# EAGLE schematic Ulticlone (EAGLE 6.6.0)

## Sheet 1 of 5
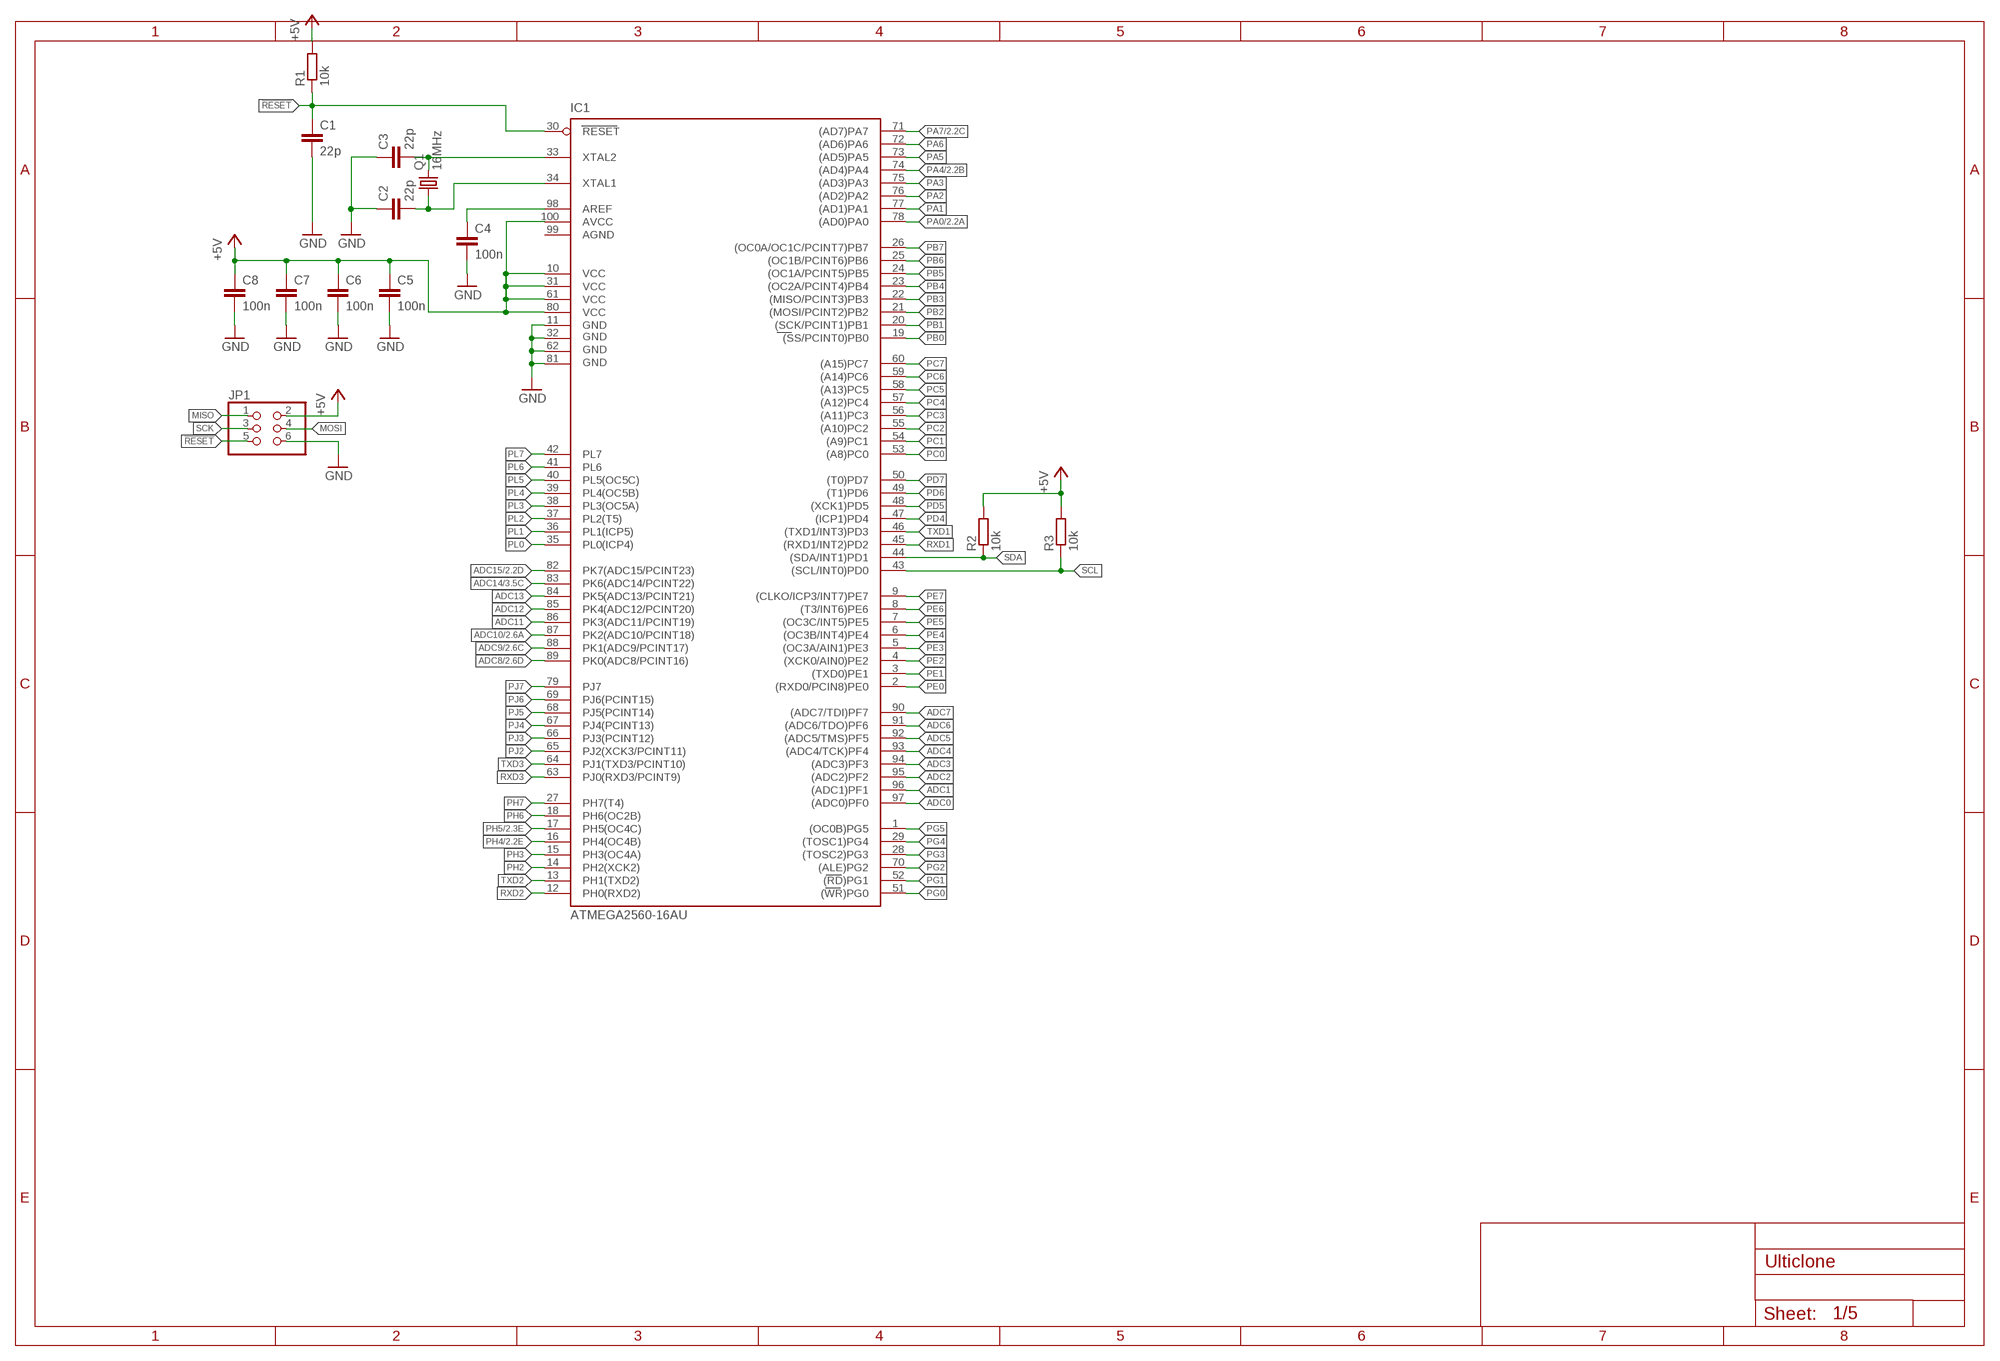
[diagram p0: schematic, sheet 1]

### Parts
C1  22p  C-EUC0603K  [C0603K]
C2  22p  C-EUC0603K  [C0603K]
C3  22p  C-EUC0603K  [C0603K]
C4  100n  C-EUC0603K  [C0603K]
C5  100n  C-EUC0603K  [C0603K]
C6  100n  C-EUC0603K  [C0603K]
C7  100n  C-EUC0603K  [C0603K]
C8  100n  C-EUC0603K  [C0603K]
IC1  ATMEGA2560-16AU  [TQFP100]
JP1  PINHD-2X3  [2X03]
Q1  16MHz  CRYSTALHC49UP  [HC49UP]
R1  10k  R-EU_R0603  [R0603]
R2  10k  R-EU_R0603  [R0603]
R3  10k  R-EU_R0603  [R0603]

### Nets
!RESET: C1.1 IC1.30(RESET) JP1.5 R1.1
+5V: C5.1 C6.1 C7.1 C8.1 IC1.10(VCC) IC1.31(VCC1) IC1.61(VCC2) IC1.80(VCC3) IC1.100(AVCC) JP1.2 R1.2 R2.2 R3.2 ; also sheet 2,3
ADC0: IC1.97((ADC0)PF0)
ADC1: IC1.96((ADC1)PF1)
ADC2: IC1.95((ADC2)PF2)
ADC3: IC1.94((ADC3)PF3)
ADC4: IC1.93((ADC4/TCK)PF4)
ADC5: IC1.92((ADC5/TMS)PF5)
ADC6: IC1.91((ADC6/TDO)PF6)
ADC7: IC1.90((ADC7/TDI)PF7)
ADC8: IC1.89(PK0(ADC8/PCINT16)) ; also sheet 2
ADC9: IC1.88(PK1(ADC9/PCINT17)) ; also sheet 2
ADC10: IC1.87(PK2(ADC10/PCINT18)) ; also sheet 2
ADC11: IC1.86(PK3(ADC11/PCINT19))
ADC12: IC1.85(PK4(ADC12/PCINT20))
ADC13: IC1.84(PK5(ADC13/PCINT21))
ADC14: IC1.83(PK6(ADC14/PCINT22)) ; also sheet 3
ADC15: IC1.82(PK7(ADC15/PCINT23)) ; also sheet 2
GND: C1.2 C2.1 C3.1 C4.2 C5.2 C6.2 C7.2 C8.2 IC1.11(GND) IC1.32(GND1) IC1.62(GND2) IC1.81(GND3) JP1.6 ; also sheet 2,3
MISO: JP1.1
MOSI: JP1.4
N$1: C3.2 IC1.33(XTAL2) Q1.2
N$2: C2.2 IC1.34(XTAL1) Q1.1
N$3: C4.1 IC1.98(AREF)
PA0: IC1.78((AD0)PA0) ; also sheet 2
PA1: IC1.77((AD1)PA1)
PA2: IC1.76((AD2)PA2)
PA3: IC1.75((AD3)PA3)
PA4: IC1.74((AD4)PA4) ; also sheet 2
PA5: IC1.73((AD5)PA5)
PA6: IC1.72((AD6)PA6)
PA7: IC1.71((AD7)PA7) ; also sheet 2
PB0: IC1.19((SS/PCINT0)PB0)
PB1: IC1.20((SCK/PCINT1)PB1)
PB2: IC1.21((MOSI/PCINT2)PB2)
PB3: IC1.22((MISO/PCINT3)PB3)
PB4: IC1.23((OC2A/PCINT4)PB4)
PB5: IC1.24((OC1A/PCINT5)PB5)
PB6: IC1.25((OC1B/PCINT6)PB6)
PB7: IC1.26((OC0A/OC1C/PCINT7)PB7)
PC0: IC1.53((A8)PC0)
PC1: IC1.54((A9)PC1)
PC2: IC1.55((A10)PC2)
PC3: IC1.56((A11)PC3)
PC4: IC1.57((A12)PC4)
PC5: IC1.58((A13)PC5)
PC6: IC1.59((A14)PC6)
PC7: IC1.60((A15)PC7)
PD4: IC1.47((ICP1)PD4)
PD5: IC1.48((XCK1)PD5)
PD6: IC1.49((T1)PD6)
PD7: IC1.50((T0)PD7)
PE0: IC1.2((RXD0/PCIN8)PE0)
PE1: IC1.3((TXD0)PE1)
PE2: IC1.4((XCK0/AIN0)PE2)
PE3: IC1.5((OC3A/AIN1)PE3)
PE4: IC1.6((OC3B/INT4)PE4)
PE5: IC1.7((OC3C/INT5)PE5)
PE6: IC1.8((T3/INT6)PE6)
PE7: IC1.9((CLKO/ICP3/INT7)PE7)
PG0: IC1.51((WR)PG0)
PG1: IC1.52((RD)PG1)
PG2: IC1.70((ALE)PG2)
PG3: IC1.28((TOSC2)PG3)
PG4: IC1.29((TOSC1)PG4)
PG5: IC1.1((OC0B)PG5)
PH2: IC1.14(PH2(XCK2))
PH3: IC1.15(PH3(OC4A))
PH4: IC1.16(PH4(OC4B)) ; also sheet 2
PH5: IC1.17(PH5(OC4C)) ; also sheet 2
PH6: IC1.18(PH6(OC2B))
PH7: IC1.27(PH7(T4))
PJ2: IC1.65(PJ2(XCK3/PCINT11))
PJ3: IC1.66(PJ3(PCINT12))
PJ4: IC1.67(PJ4(PCINT13))
PJ5: IC1.68(PJ5(PCINT14))
PJ6: IC1.69(PJ6(PCINT15))
PJ7: IC1.79(PJ7)
PL0: IC1.35(PL0(ICP4))
PL1: IC1.36(PL1(ICP5))
PL2: IC1.37(PL2(T5))
PL3: IC1.38(PL3(OC5A))
PL4: IC1.39(PL4(OC5B))
PL5: IC1.40(PL5(OC5C))
PL6: IC1.41(PL6)
PL7: IC1.42(PL7)
RXD1: IC1.45((RXD1/INT2)PD2)
RXD2: IC1.12(PH0(RXD2))
RXD3: IC1.63(PJ0(RXD3/PCINT9))
SCK: JP1.3
SCL: IC1.43((SCL/INT0)PD0) R3.1
SDA: IC1.44((SDA/INT1)PD1) R2.1
TXD1: IC1.46((TXD1/INT3)PD3)
TXD2: IC1.13(PH1(TXD2))
TXD3: IC1.64(PJ1(TXD3/PCINT10))

## Sheet 2 of 5
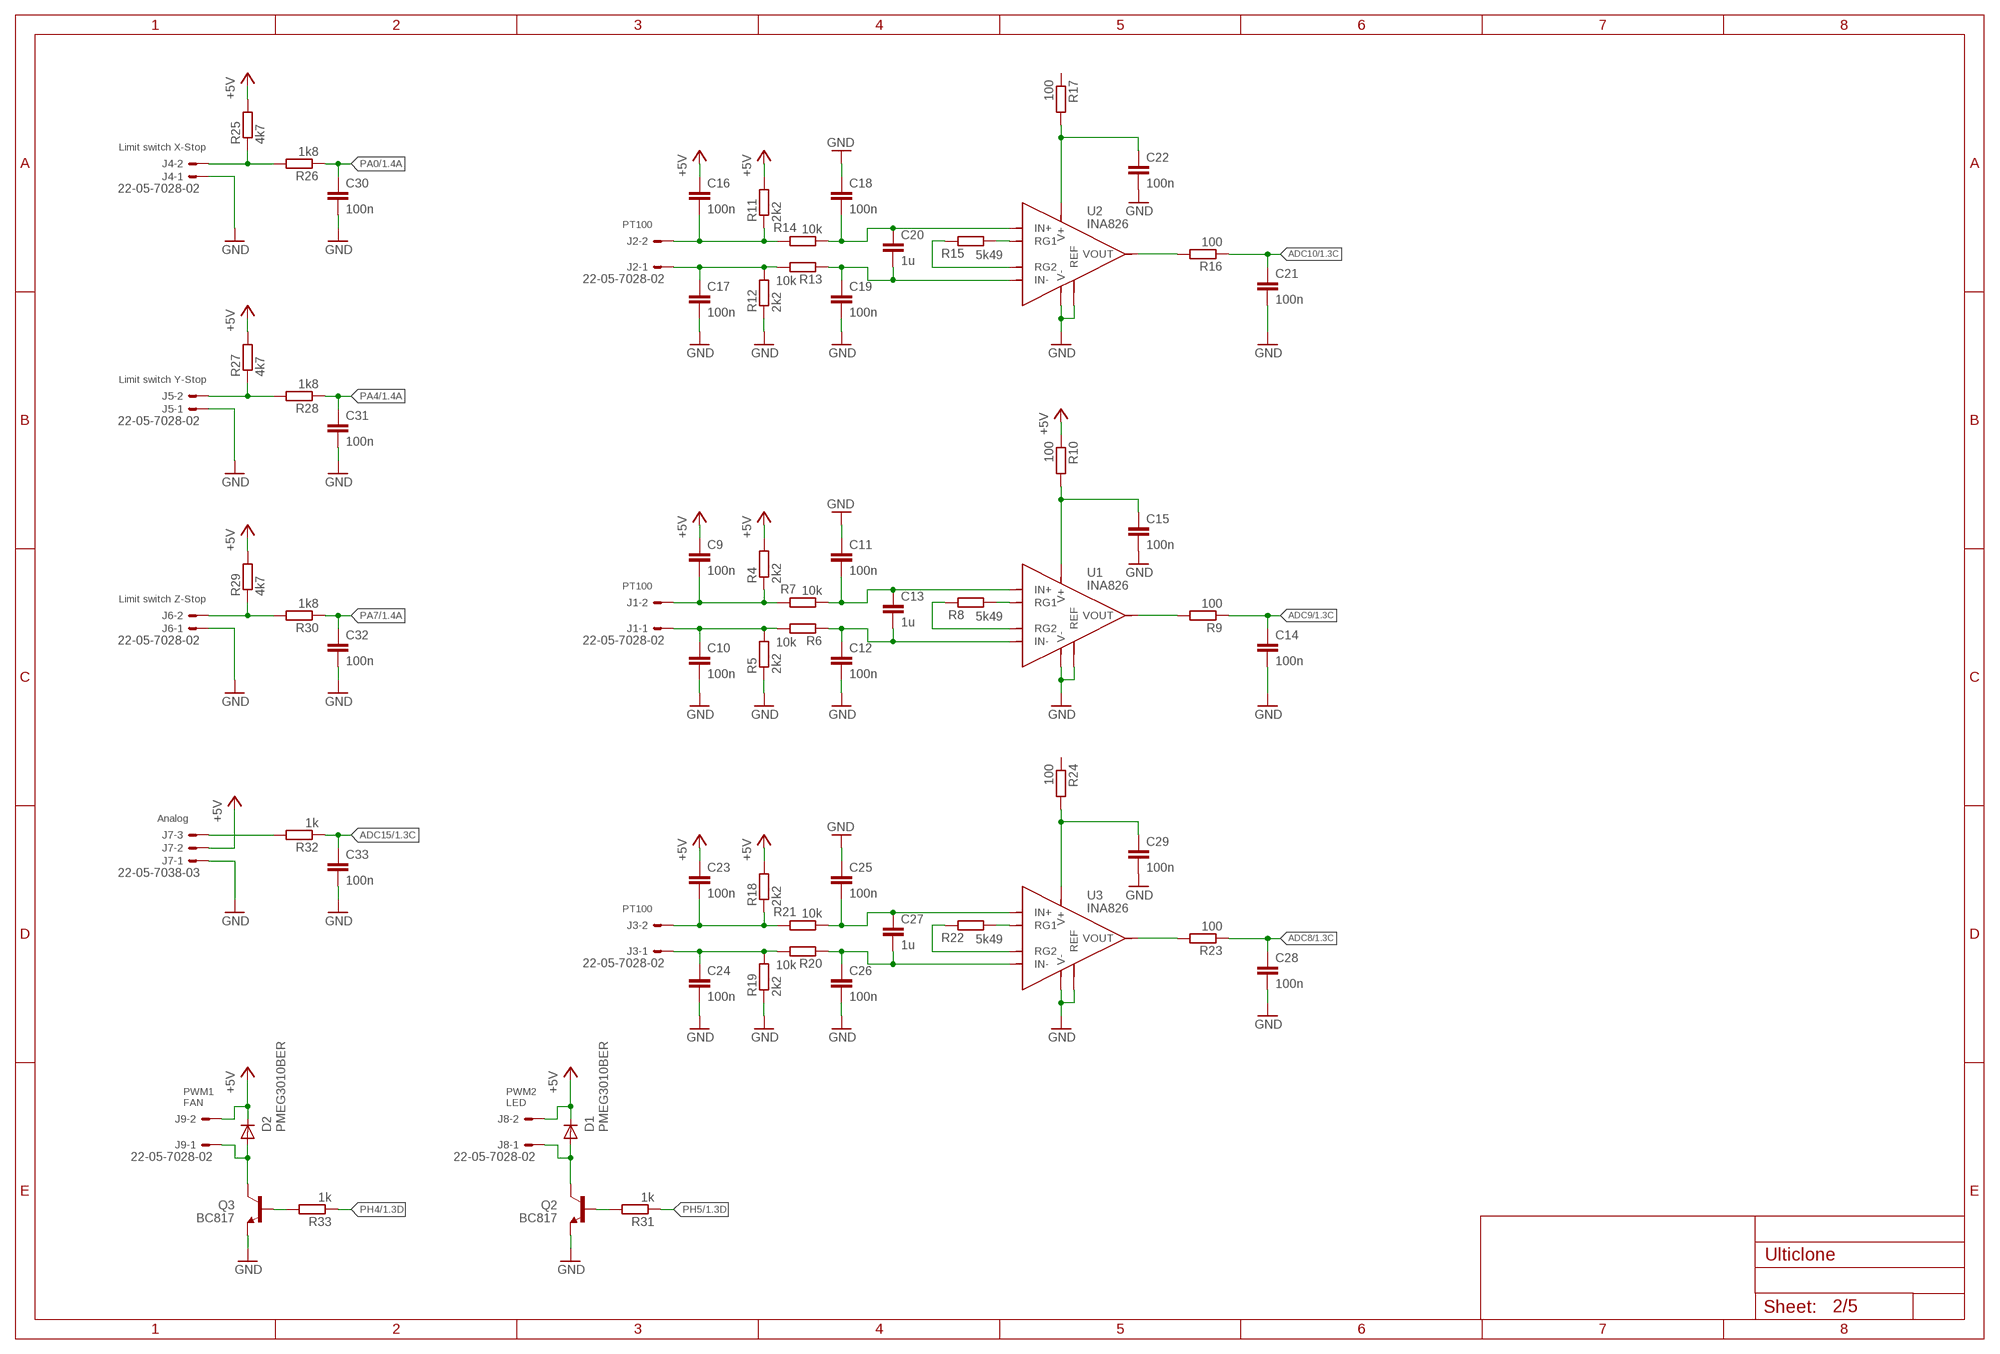
[diagram p1: schematic, sheet 2]

### Parts
C9  100n  C-EUC0603K  [C0603K]
C10  100n  C-EUC0603K  [C0603K]
C11  100n  C-EUC0603K  [C0603K]
C12  100n  C-EUC0603K  [C0603K]
C13  1u  C-EUC0805K  [C0805K]
C14  100n  C-EUC0603K  [C0603K]
C15  100n  C-EUC0603K  [C0603K]
C16  100n  C-EUC0603K  [C0603K]
C17  100n  C-EUC0603K  [C0603K]
C18  100n  C-EUC0603K  [C0603K]
C19  100n  C-EUC0603K  [C0603K]
C20  1u  C-EUC0805K  [C0805K]
C21  100n  C-EUC0603K  [C0603K]
C22  100n  C-EUC0603K  [C0603K]
C23  100n  C-EUC0603K  [C0603K]
C24  100n  C-EUC0603K  [C0603K]
C25  100n  C-EUC0603K  [C0603K]
C26  100n  C-EUC0603K  [C0603K]
C27  1u  C-EUC0805K  [C0805K]
C28  100n  C-EUC0603K  [C0603K]
C29  100n  C-EUC0603K  [C0603K]
C30  100n  C-EUC0603K  [C0603K]
C31  100n  C-EUC0603K  [C0603K]
C32  100n  C-EUC0603K  [C0603K]
C33  100n  C-EUC0603K  [C0603K]
D1  PMEG3010BER  DIODE-SOD123  [SOD123]
D2  PMEG3010BER  DIODE-SOD123  [SOD123]
J1  22-05-7028-02  [7395-02]
J2  22-05-7028-02  [7395-02]
J3  22-05-7028-02  [7395-02]
J4  22-05-7028-02  [7395-02]
J5  22-05-7028-02  [7395-02]
J6  22-05-7028-02  [7395-02]
J7  22-05-7038-03  [7395-03]
J8  22-05-7028-02  [7395-02]
J9  22-05-7028-02  [7395-02]
Q2  BC817  BC817-16SMD  [SOT23-BEC]
Q3  BC817  BC817-16SMD  [SOT23-BEC]
R4  2k2  R-EU_R0603  [R0603]
R5  2k2  R-EU_R0603  [R0603]
R6  10k  R-EU_R0603  [R0603]
R7  10k  R-EU_R0603  [R0603]
R8  5k49  R-EU_R0603  [R0603]
R9  100  R-EU_R0603  [R0603]
R10  100  R-EU_R0603  [R0603]
R11  2k2  R-EU_R0603  [R0603]
R12  2k2  R-EU_R0603  [R0603]
R13  10k  R-EU_R0603  [R0603]
R14  10k  R-EU_R0603  [R0603]
R15  5k49  R-EU_R0603  [R0603]
R16  100  R-EU_R0603  [R0603]
R17  100  R-EU_R0603  [R0603]
R18  2k2  R-EU_R0603  [R0603]
R19  2k2  R-EU_R0603  [R0603]
R20  10k  R-EU_R0603  [R0603]
R21  10k  R-EU_R0603  [R0603]
R22  5k49  R-EU_R0603  [R0603]
R23  100  R-EU_R0603  [R0603]
R24  100  R-EU_R0603  [R0603]
R25  4k7  R-EU_R0603  [R0603]
R26  1k8  R-EU_R0603  [R0603]
R27  4k7  R-EU_R0603  [R0603]
R28  1k8  R-EU_R0603  [R0603]
R29  4k7  R-EU_R0603  [R0603]
R30  1k8  R-EU_R0603  [R0603]
R31  1k  R-EU_R0603  [R0603]
R32  1k  R-EU_R0603  [R0603]
R33  1k  R-EU_R0603  [R0603]
U1  INA826  [SO-8]
U2  INA826  [SO-8]
U3  INA826  [SO-8]

### Nets
+5V: C9.1 C16.1 C23.1 D1.C D2.C J7.2 J8.2 J9.2 R4.2 R10.1 R11.2 R18.2 R25.2 R27.2 R29.2 ; also sheet 1,3
ADC8: C28.1 R23.1 ; also sheet 1
ADC9: C14.1 R9.1 ; also sheet 1
ADC10: C21.1 R16.1 ; also sheet 1
ADC15: C33.1 R32.1 ; also sheet 1
GND: C10.2 C11.1 C12.2 C14.2 C15.2 C17.2 C18.1 C19.2 C21.2 C22.2 C24.2 C25.1 C26.2 C28.2 C29.2 C30.2 C31.2 C32.2 C33.2 J4.1 J5.1 J6.1 J7.1 Q2.E Q3.E R5.1 R12.1 R19.1 U1.P$5(V-) U1.P$6(REF) U2.P$5(V-) U2.P$6(REF) U3.P$5(V-) U3.P$6(REF) ; also sheet 1,3
N$4: C9.2 J1.2 R4.1 R7.2
N$5: R8.2 U1.P$3(RG2)
N$6: C10.1 J1.1 R5.2 R6.2
N$7: C11.2 C13.1 R7.1 U1.P$4(IN+)
N$8: C12.1 C13.2 R6.1 U1.P$1(IN-)
N$9: R8.1 U1.P$2(RG1)
N$10: R9.2 U1.P$7(VOUT)
N$11: C15.1 R10.2 U1.P$8(V+)
N$12: J4.2 R25.1 R26.2
N$13: J7.3 R32.2
N$14: J5.2 R27.1 R28.2
N$15: J6.2 R29.1 R30.2
N$16: C16.2 J2.2 R11.1 R14.2
N$17: C17.1 J2.1 R12.2 R13.2
N$18: C18.2 C20.1 R14.1 U2.P$4(IN+)
N$19: C19.1 C20.2 R13.1 U2.P$1(IN-)
N$20: R15.1 U2.P$2(RG1)
N$21: R15.2 U2.P$3(RG2)
N$22: R16.2 U2.P$7(VOUT)
N$23: C22.1 R17.2 U2.P$8(V+)
N$24: C23.2 J3.2 R18.1 R21.2
N$25: C24.1 J3.1 R19.2 R20.2
N$26: C25.2 C27.1 R21.1 U3.P$4(IN+)
N$27: C26.1 C27.2 R20.1 U3.P$1(IN-)
N$28: R22.1 U3.P$2(RG1)
N$29: R22.2 U3.P$3(RG2)
N$30: R23.2 U3.P$7(VOUT)
N$31: C29.1 R24.2 U3.P$8(V+)
N$32: D1.A J8.1 Q2.C
N$35: Q2.B R31.2
N$37: D2.A J9.1 Q3.C
N$38: Q3.B R33.2
PA0: C30.1 R26.1 ; also sheet 1
PA4: C31.1 R28.1 ; also sheet 1
PA7: C32.1 R30.1 ; also sheet 1
PH4: R33.1 ; also sheet 1
PH5: R31.1 ; also sheet 1
Unconnected: R17.1 R24.1

### Notes on the sheet
- Limit switch X-Stop
- PT100
- Limit switch Y-Stop
- PT100
- Limit switch Z-Stop
- Analog
- PT100
- PWM1
  FAN
- PWM2
  LED

## Sheet 3 of 5
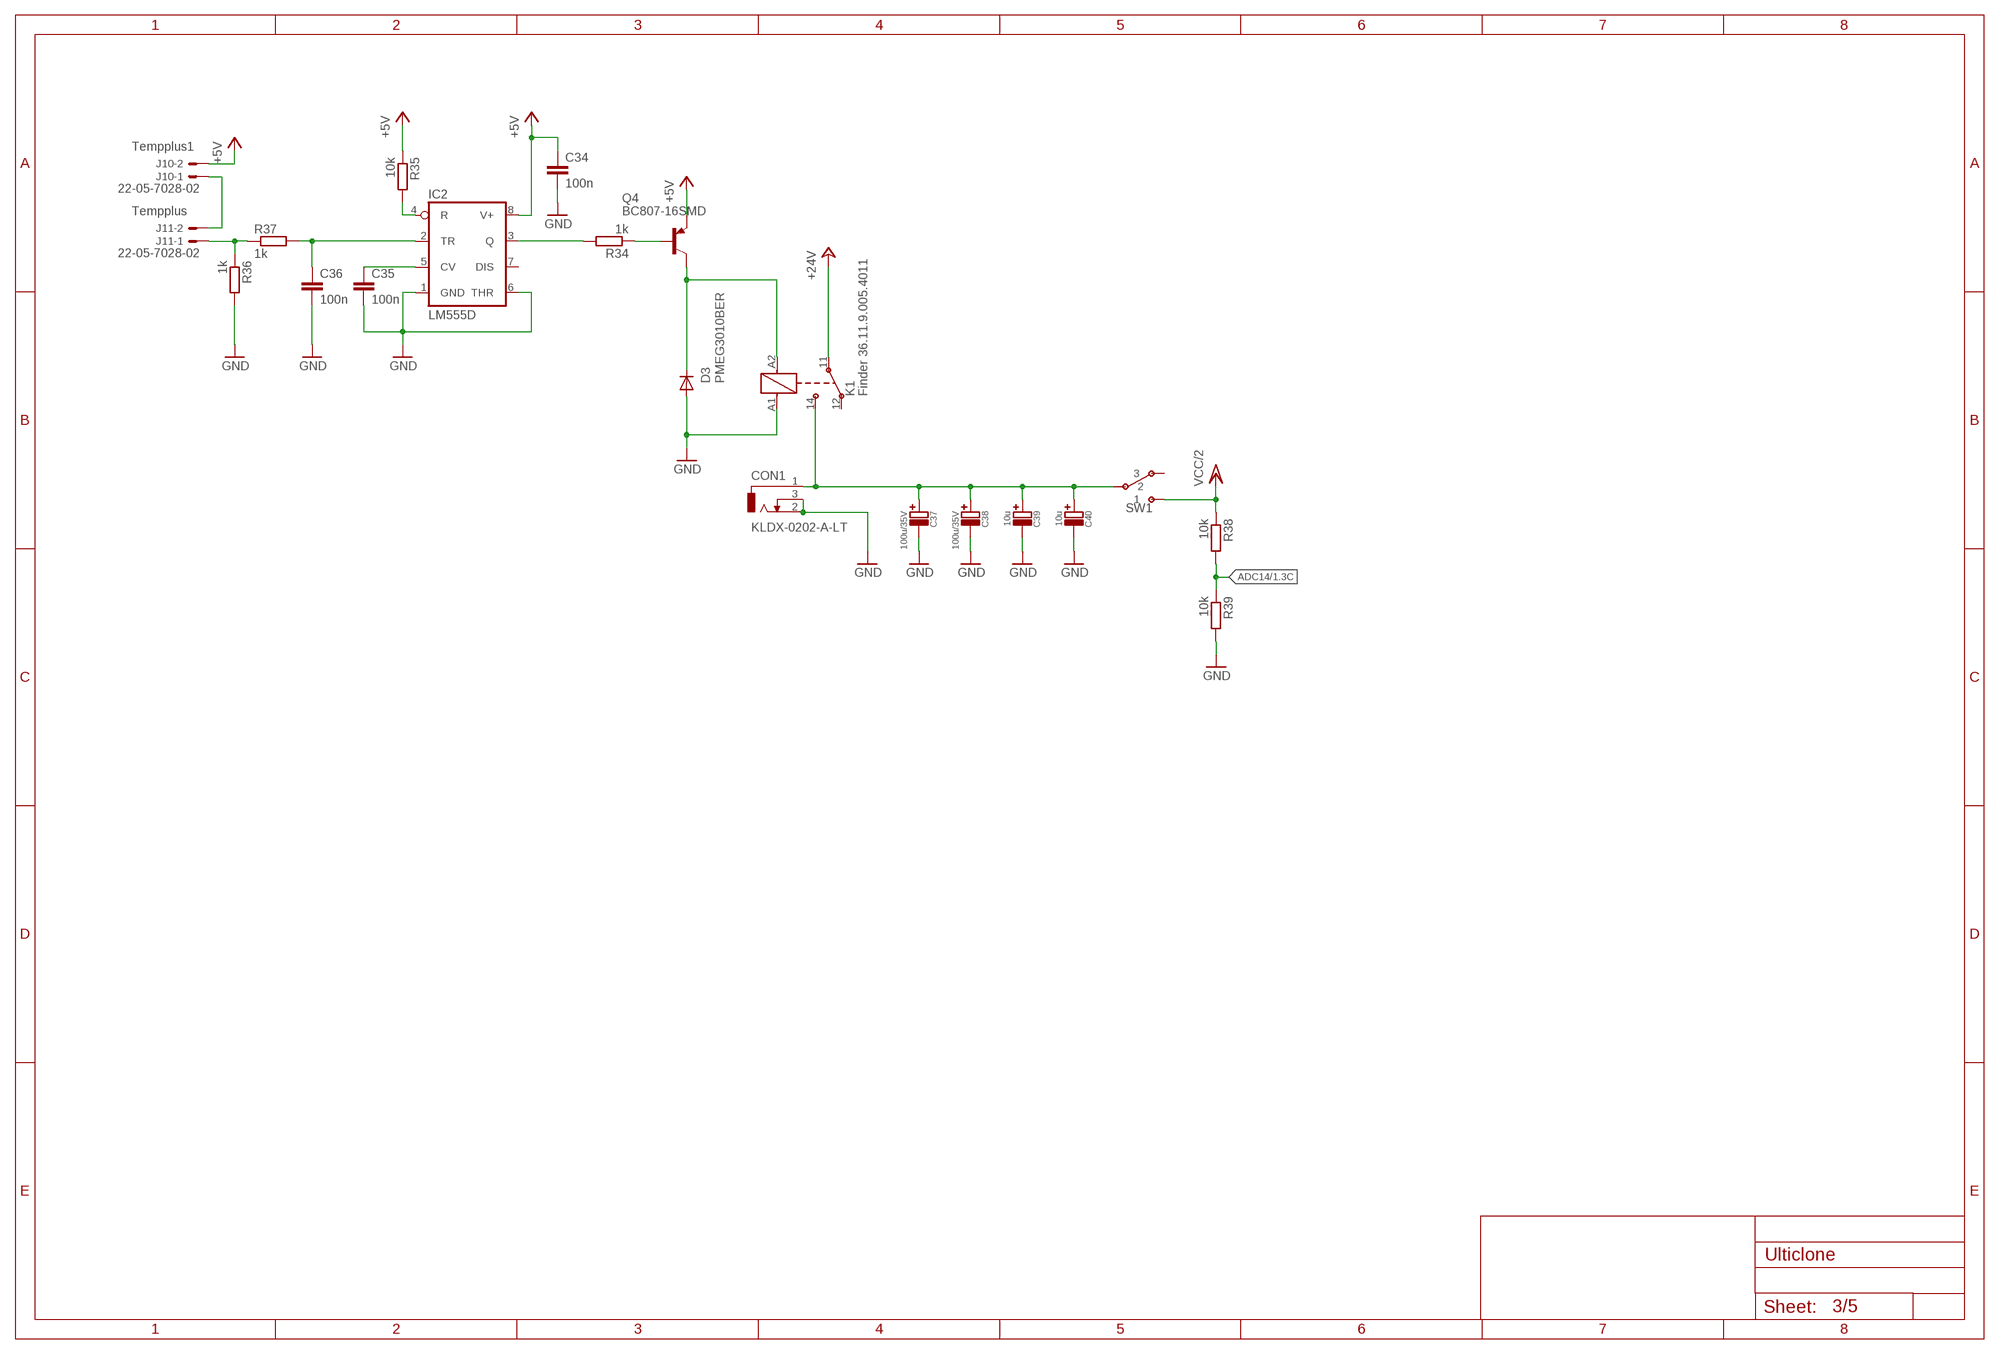
[diagram p2: schematic, sheet 3]

### Parts
C34  100n  C-EUC0603K  [C0603K]
C35  100n  C-EUC0603K  [C0603K]
C36  100n  C-EUC0603K  [C0603K]
C37  100u/35V  C_POL4X4MM  [C_POL_4X4MM]
C38  100u/35V  C_POL4X4MM  [C_POL_4X4MM]
C39  10u  C_POL4X4MM  [C_POL_4X4MM]
C40  10u  C_POL4X4MM  [C_POL_4X4MM]
CON1  KLDX-0202-A-LT  [KLDX-0202-A-LT]
D3  PMEG3010BER  DIODE-SOD123  [SOD123]
IC2  LM555D  [SO08]
J10  22-05-7028-02  [7395-02]
J11  22-05-7028-02  [7395-02]
K1  Finder 36.11.9.005.4011  36.11  [36.11]
Q4  BC807-16SMD  [SOT23-BEC]
R34  1k  R-EU_R0603  [R0603]
R35  10k  R-EU_R0603  [R0603]
R36  1k  R-EU_R0603  [R0603]
R37  1k  R-EU_R0603  [R0603]
R38  10k  R-EU_R0603  [R0603]
R39  10k  R-EU_R0603  [R0603]
SW1  SW-SPDT-4MS1R202BM6NQNS  [SW-SPDT-4MS1R202BM6NQNS]

### Nets
+5V: C34.1 IC2.8(V+) J10.2 Q4.E R35.1 ; also sheet 1,2
+24V: K1.11
ADC14: R38.2 R39.1 ; also sheet 1
GND: C34.2 C35.2 C36.2 C37.- C38.- C39.- C40.- CON1.2 CON1.3 D3.A IC2.1(GND) IC2.6(THR) K1.A1 R36.2 R39.2 ; also sheet 1,2
N$33: D3.C K1.A2 Q4.C
N$34: J10.1 J11.2
N$36: C37.+ C38.+ C39.+ C40.+ CON1.1 K1.14 SW1.2
N$39: C35.1 IC2.5(CV)
N$40: C36.1 IC2.2(TR) R37.2
N$41: J11.1 R36.1 R37.1
N$42: IC2.4(R) R35.2
N$46: IC2.3(Q) R34.2
N$47: Q4.B R34.1
VCC/2: R38.1 SW1.1
Unconnected: IC2.7(DIS) K1.12 SW1.3

### Notes on the sheet
- Tempplus1
- Tempplus

## Sheet 4 of 5
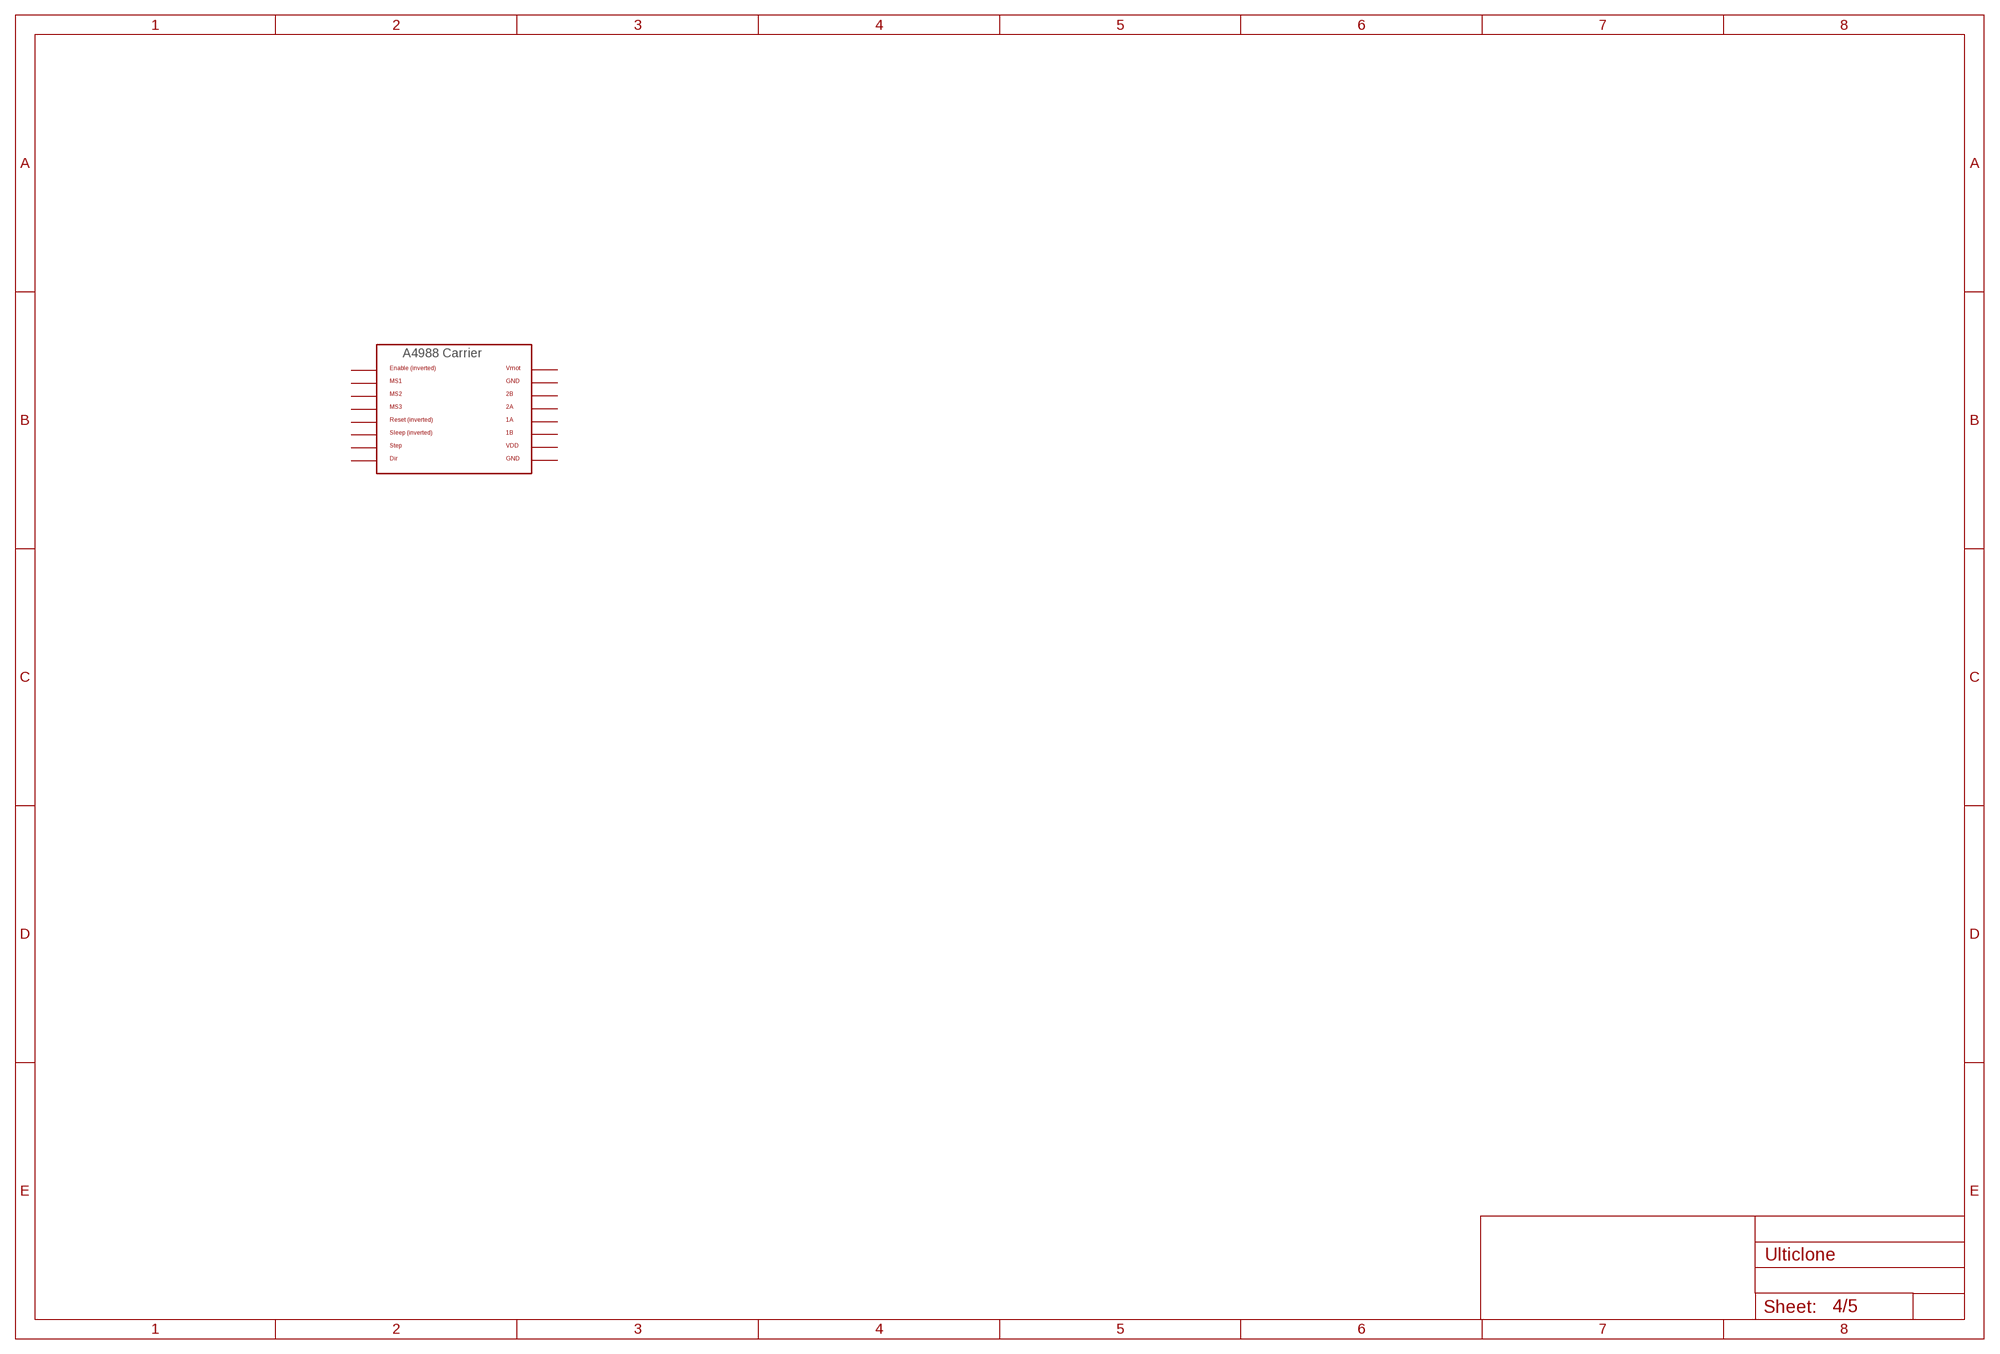
[diagram p3: schematic, sheet 4]

### Parts
U$1  A4983CARRIER  [A4988BREAKOUT]
Unconnected: U$1.1A U$1.1B U$1.2A U$1.2B U$1.DIR U$1.EN U$1.MS1 U$1.MS2 U$1.MS3 U$1.RST U$1.SLP(SLEEP) U$1.STEP

## Sheet 5 of 5
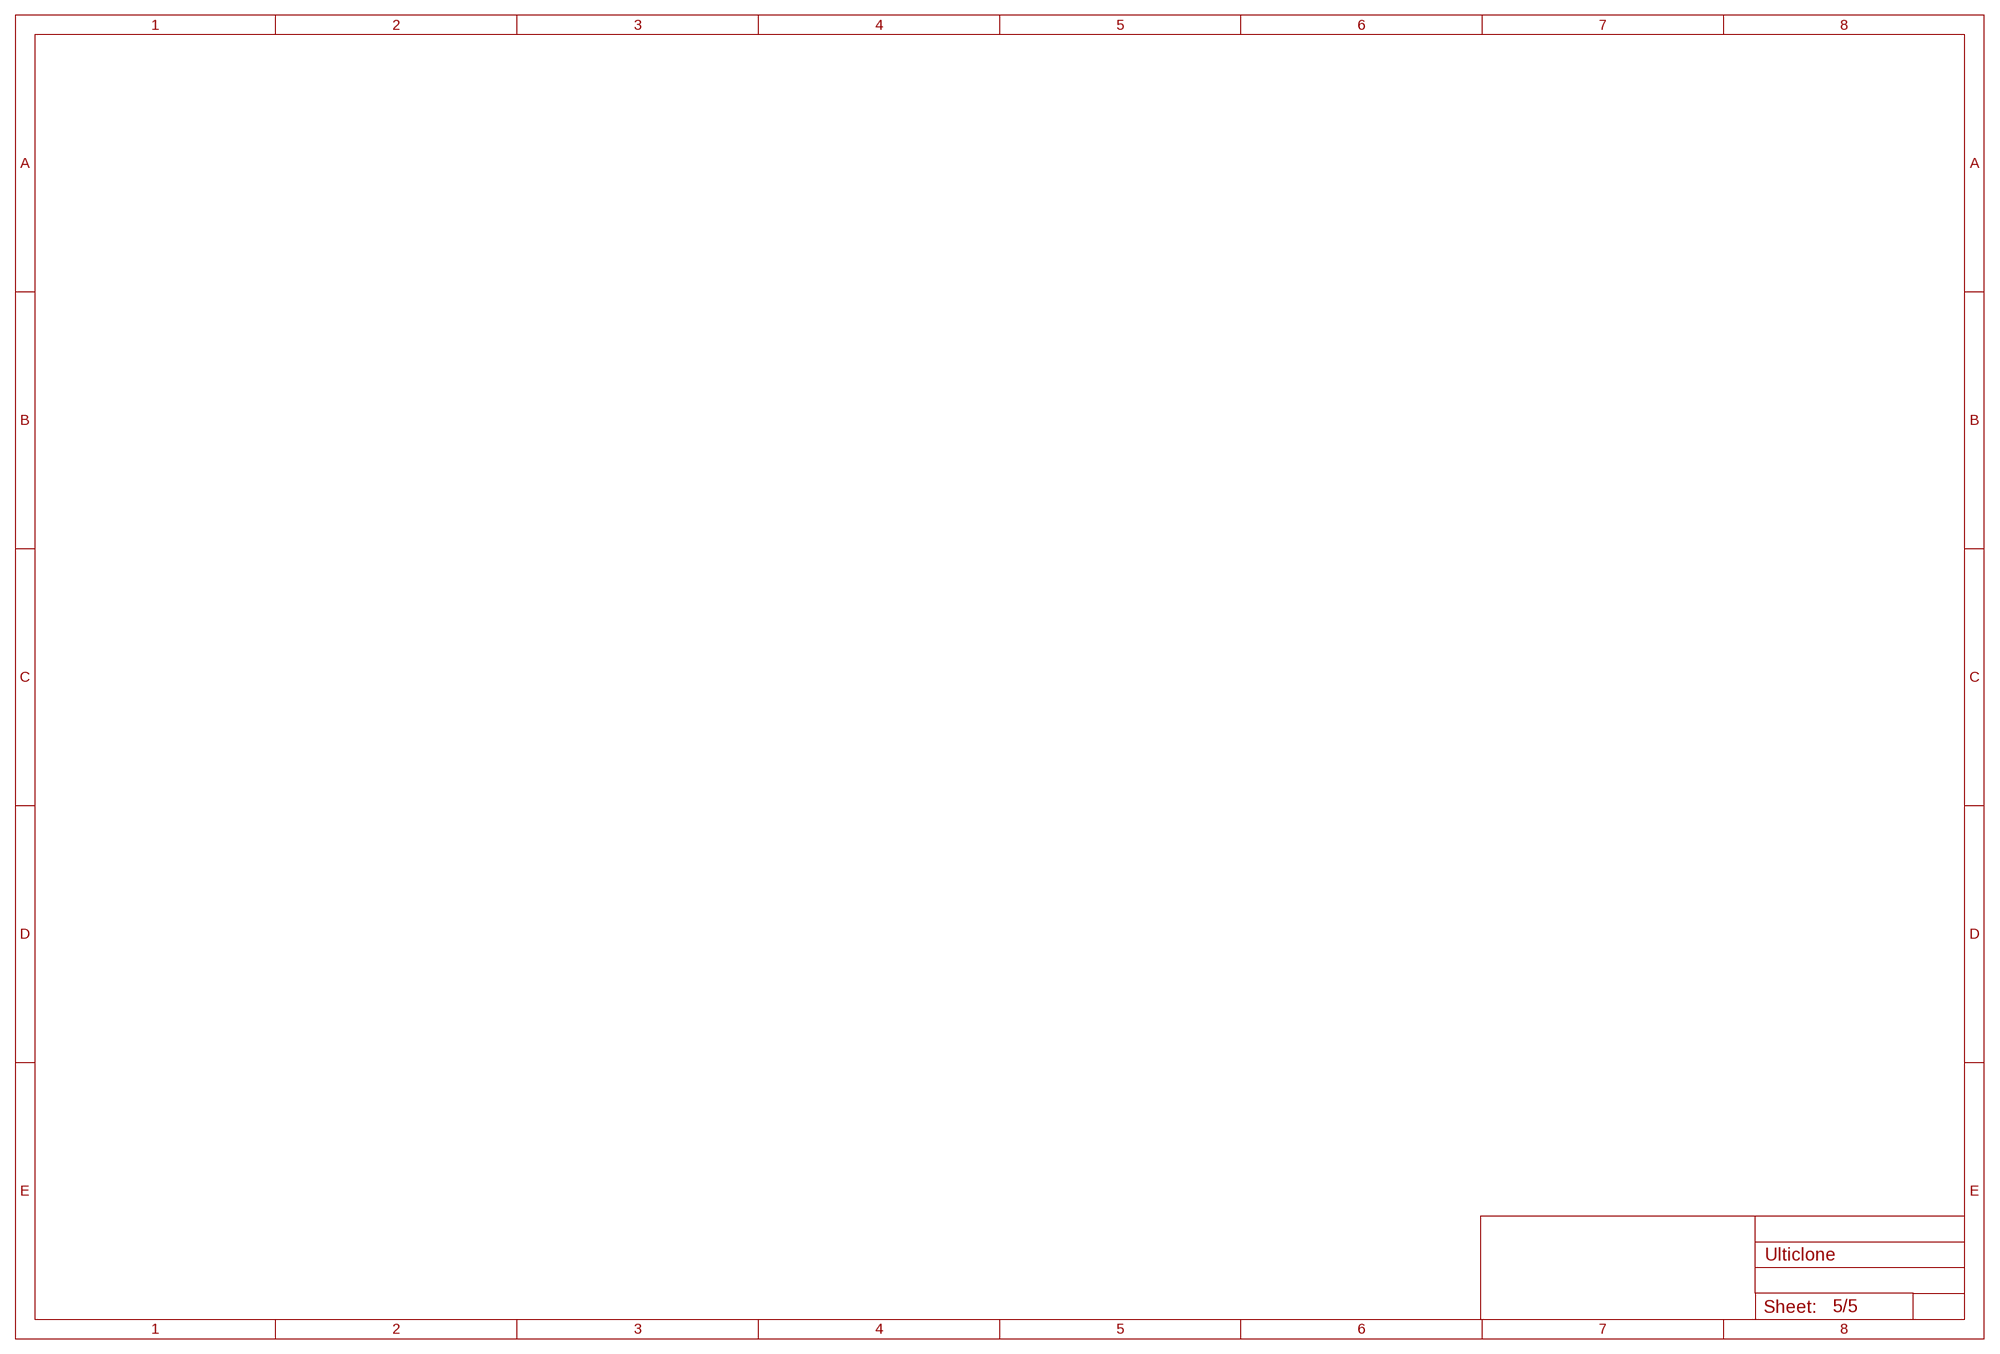
[diagram p4: schematic, sheet 5]

## Power pins joined to a net without a drawn wire
AGND: IC1.99(AGND)
GND: U$1.GND U$1.GND@0(GND)
VDD: U$1.VDD
VMOT: U$1.VMOT

## Library data of the parts
C1-C36 = rcl:C-EU: CAPACITOR, European symbol
C37-C40 = SchlegelAr_Master:C_POL: C Pol last modified: Armin Schlegel, 20.03.2014
CON1 = SchlegelAr_Master:KLDX-0202-A-LT: KLDX-0202-A-LT - DC-Spannungsversorgungssteckverbinder 2.0mm PCB JACK LOCKING TYPE last modified: Armin Schlegel, 28.04.2014 http://de.mouser.com/ProductDetail/Kycon/KLDX-0202-A-LT/?qs=%2fha2pyFadug6yAePtFHF%252bYgVUqD4usJO%252bzszO19jtQE%252bUyITMB7Piw%3d%3d http://www.mouser.com/ds/2/222/KLDX_0202_LT-221016.pdf
D1-D3 = diode:DIODE-: DIODE
IC1 = atmel-2005:ATMEGA*: MICROCONTROLLER 64/128/256 Kbytes FLASH 4 Kbytes EEPROM 8 Kbytes SRAM 86 General Purpose I/O pins 12-channels16-bit PWM 4 x Serial USARTs 16-channels 10-bit A/D
IC2 = linear:*555: TIMER
J1-J6 J8-J11 = con-molex:22-?-02: CONNECTOR wire to board 2.54 mm (.1 inch) pitch header; OC_FARNELL: 9731601; OC_NEWARK: unknown
J7 = con-molex:22-?-03: CONNECTOR wire to board 2.54 mm (.1 inch) pitch header; OC_FARNELL: unknown; OC_NEWARK: unknown
JP1 = pinhead:PINHD-2X3: PIN HEADER
K1 = relay_finder_36_11:36.11: Printed circuit mount miniature 10 A relay one pole changeover contacts Conform RoHS
Q1 = crystal:CRYSTAL: CRYSTAL; OC_FARNELL: unknown; OC_NEWARK: unknown
Q2 Q3 = transistor-npn:BC817*: NPN Transistor
Q4 = transistor-pnp:BC807*: PNP Transistror
R1-R39 = rcl:R-EU_: RESISTOR, European symbol
SW1 = SchlegelAr_Master:SW-SPDT-4MS1R202BM6NQNS: RS Pro 4MS1R202BM6NQNS Wippschalter 1-poliger Umschalter, Ein-Ein, schwarz RS Best.-Nr.734-6918 MarkeRS Pro Herst. Teile-Nr.4MS1R202BM6NQNS https://de.rs-online.com/web/p/wippschalter/7346918/?searchTerm=734-6918&relevancy-data=636F3D3126696E3D4931384E525353746F636B4E756D6265724D504E266C753D656E266D6D3D6D61746368616C6C26706D3D5E283F69292852537C5253207C52532D293F5C647B337D285C73293F5B5C732D2F255C2E2C5D285C73293F5C647B332C347D2426706F3D313426736E3D592673743D52535F53544F434B5F4E554D4245522677633D4E4F4E45267573743D3733342D36393138267374613D3733343639313826>
U1-U3 = ecgparts:INA826
U$1 = RepRapjr:A4983CARRIER